# Altium project USV-Central Controller Board.PrjPcb (part 2 of 2)

## Sheet Communication.SchDoc
size 420 x 297 mm; SheetNumber: 3; SheetTotal: 6
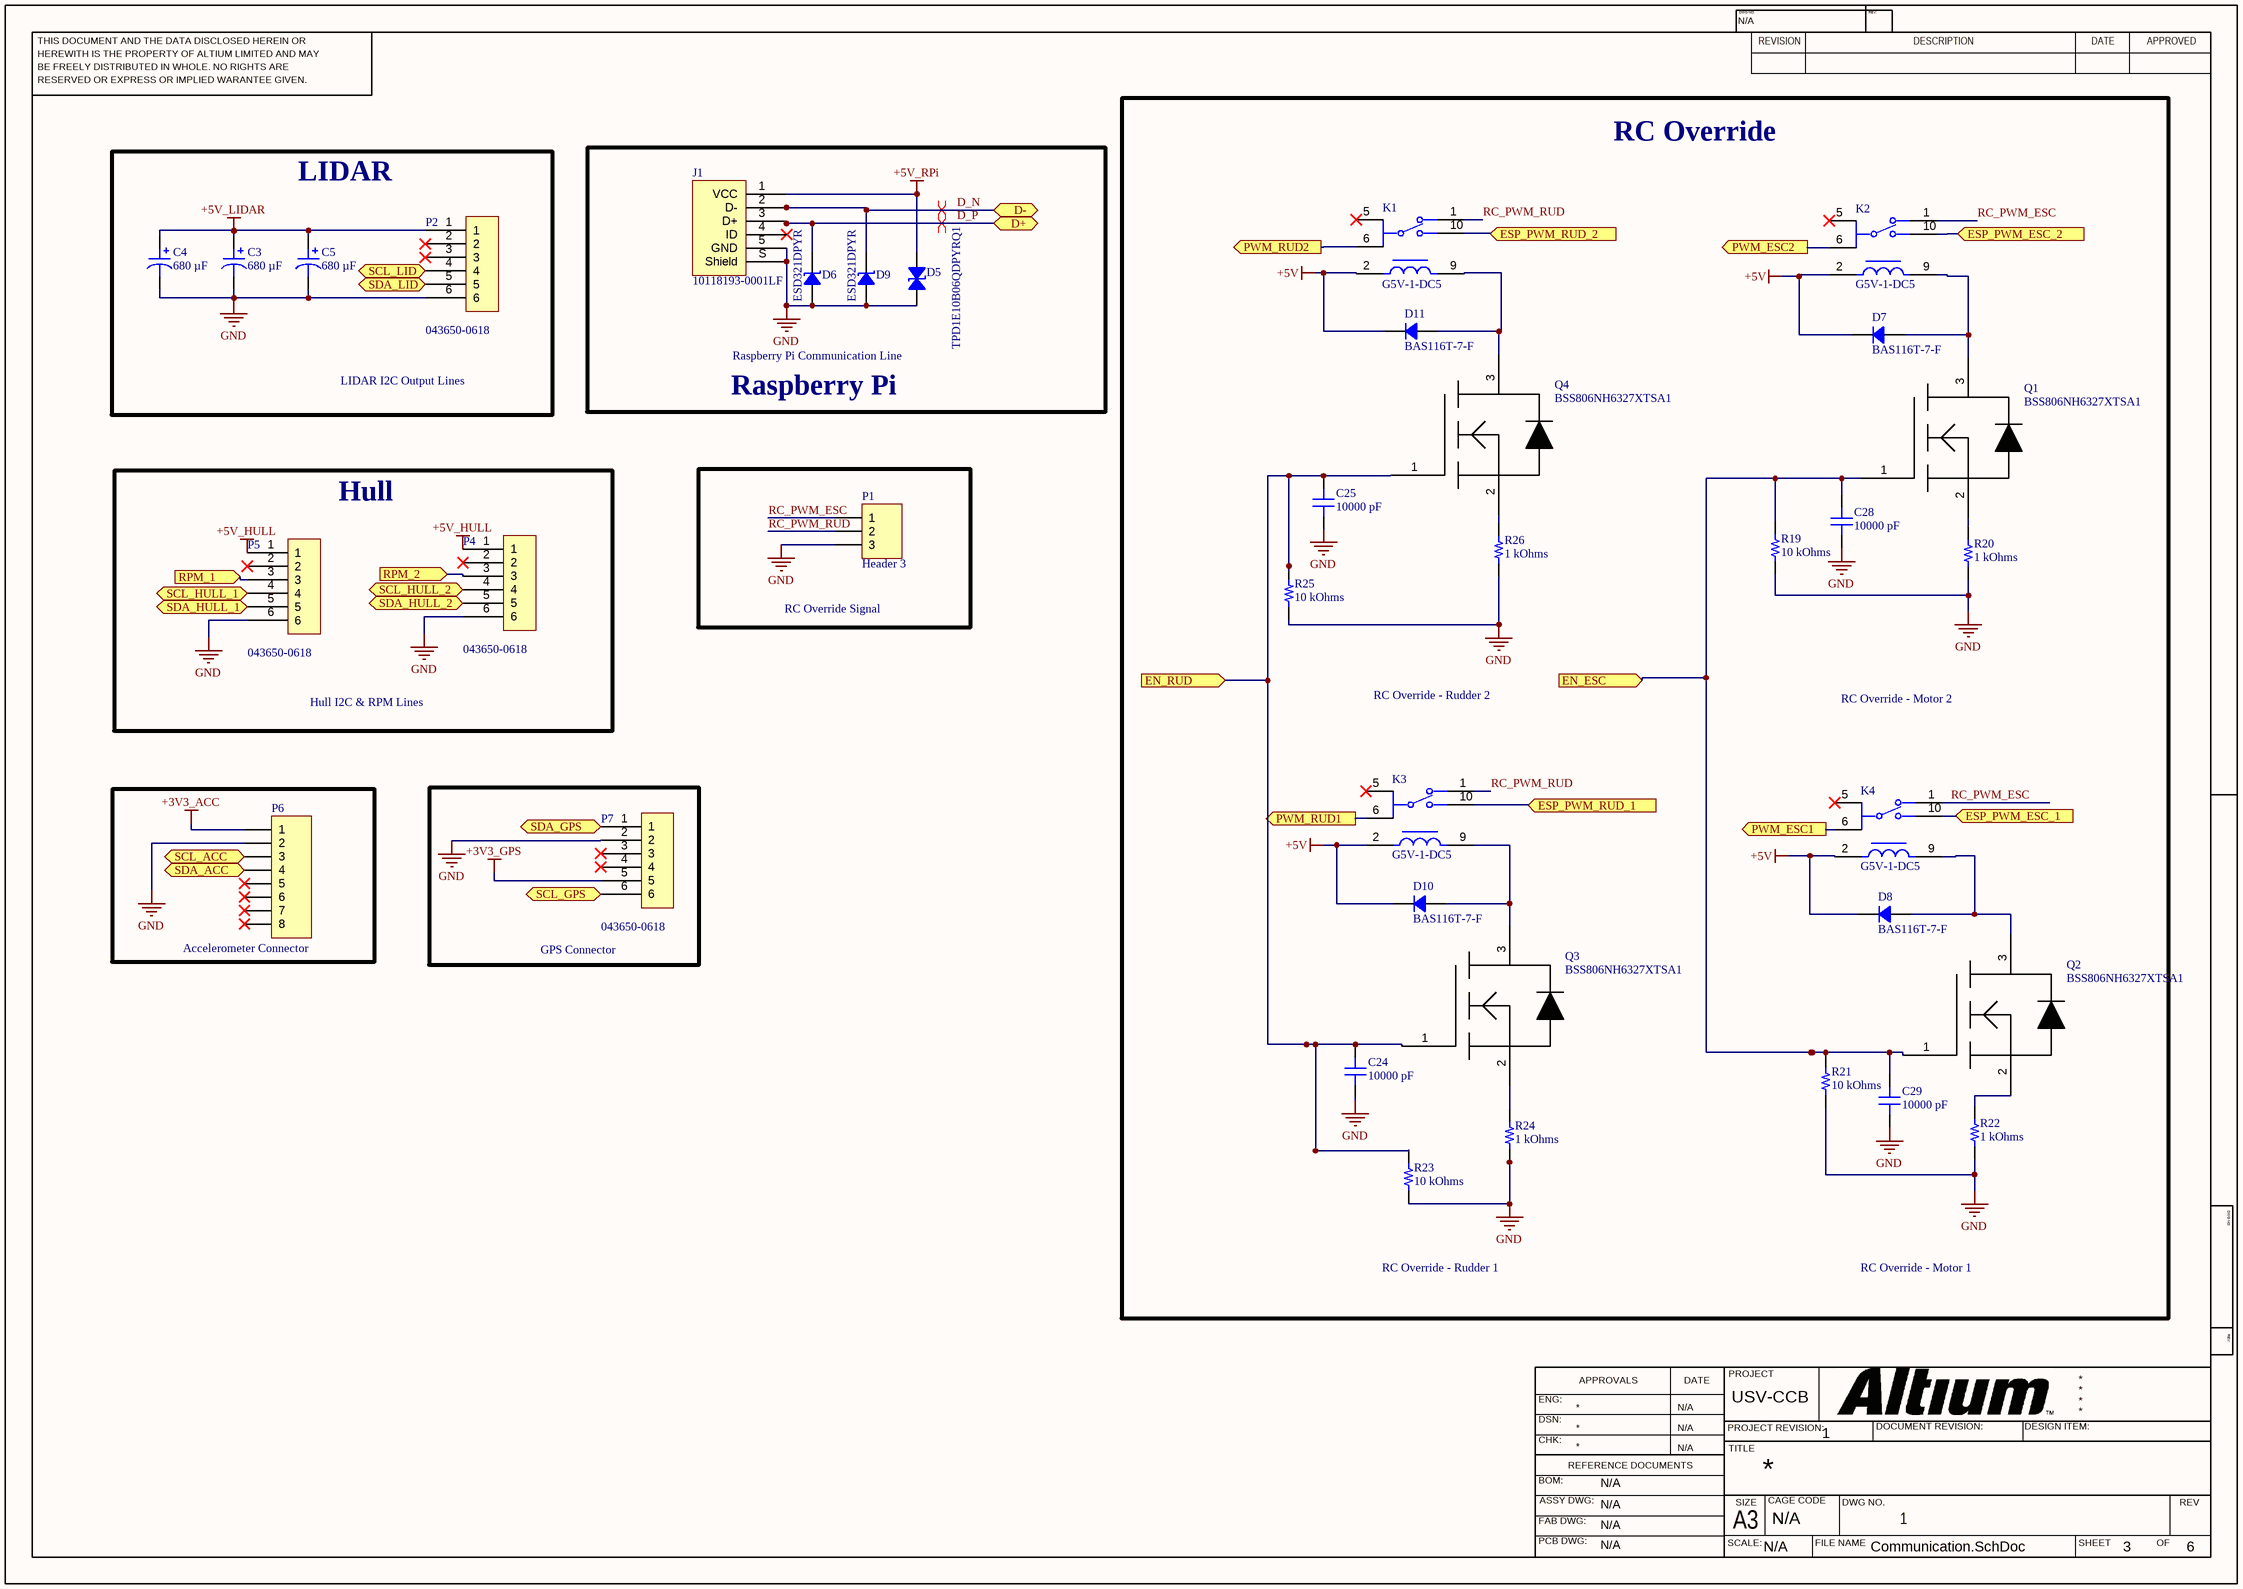
[diagram p4: Communication.SchDoc]

### Parts
C3  680 µF  [CAP ALSMD 8.3MM H10.5MM]
C4  680 µF  [CAP ALSMD 8.3MM H10.5MM]
C5  680 µF  [CAP ALSMD 8.3MM H10.5MM]
C24  10000 pF  [CAP 0603_1608]
C25  10000 pF  [CAP 0603_1608]
C28  10000 pF  [CAP 0603_1608]
C29  10000 pF  [CAP 0603_1608]
D5  TPD1E10B06QDPYRQ1  [0402]
D6  ESD321DPYR  [0402]
D7  BAS116T-7-F  [DIODES SOT-523]
D8  BAS116T-7-F  [DIODES SOT-523]
D9  ESD321DPYR  [0402]
D10  BAS116T-7-F  [DIODES SOT-523]
D11  BAS116T-7-F  [DIODES SOT-523]
J1  10118193-0001LF  [FCI USB 10118193-0001LF]
K1  G5V-1-DC5  [FP-G5V-1-MFG]
K2  G5V-1-DC5  [FP-G5V-1-MFG]
K3  G5V-1-DC5  [FP-G5V-1-MFG]
K4  G5V-1-DC5  [FP-G5V-1-MFG]
P1  Header 3  [HDR1X3]
P2  043650-0618  [043650-0618-Footprint-1]
P4  043650-0618  [043650-0618-Footprint-1]
P5  043650-0618  [043650-0618-Footprint-1]
P6  Accelerometer Connector  [HDR1X8]
P7  043650-0618  [043650-0618-Footprint-1]
Q1  BSS806NH6327XTSA1  [SOT95P255X100-3N]
Q2  BSS806NH6327XTSA1  [SOT95P255X100-3N]
Q3  BSS806NH6327XTSA1  [SOT95P255X100-3N]
Q4  BSS806NH6327XTSA1  [SOT95P255X100-3N]
R19  10 kOhms  [RES 0603_1608]
R20  1 kOhms  [RES 0603_1608]
R21  10 kOhms  [RES 0603_1608]
R22  1 kOhms  [RES 0603_1608]
R23  10 kOhms  [RES 0603_1608]
R24  1 kOhms  [RES 0603_1608]
R25  10 kOhms  [RES 0603_1608]
R26  1 kOhms  [RES 0603_1608]

### Blocks framed on the sheet
RC Override: C24 C25 C28 C29 D7 D8 D10 D11 K1-K4 Q1-Q4 R19-R26
LIDAR: C3-C5 P2
Raspberry Pi: D5 D6 D9 J1
Hull: P4 P5
RC Override Signal: P1
GPS Connector: P7

### Ports
D+ (bidir), D- (bidir), EN_ESC (in), EN_RUD (in), ESP_PWM_ESC_1 (in), ESP_PWM_ESC_2 (in), ESP_PWM_RUD_1 (in), ESP_PWM_RUD_2 (in), PWM_ESC1 (out), PWM_ESC2 (out), PWM_RUD1 (out), PWM_RUD2 (out), RPM_1 (in), RPM_2 (in), SCL_ACC (bidir), SCL_GPS (bidir), SCL_HULL_1 (bidir), SCL_HULL_2 (bidir), SCL_LID (bidir), SDA_ACC (bidir), SDA_GPS (bidir), SDA_HULL_1 (bidir), SDA_HULL_2 (bidir), SDA_LID (bidir)

### Nets
+3V3_ACC: P6.1
+3V3_GPS: P7.5
+5V: D7.2 D8.2 D10.2 D11.2 K1.2 K2.2 K3.2 K4.2
+5V_HULL: P4.1 P5.1
+5V_LIDAR: C3.1 C4.1 C5.1 P2.1
+5V_RPi: D5.1 J1.1(VCC)
GND: C3.2 C4.2 C5.2 C24.2 C25.2 C28.2 C29.2 D5.2 D6.1 D9.1 J1.5(GND) J1.S(Shield) P1.3 P2.6 P4.6 P5.6 P6.2 P7.2 R19.1 R20.1 R21.1 R22.1 R23.1 R24.1 R25.1 R26.1
D_N: D9.2 J1.2(D-) ; port D-
D_P: D6.2 J1.3(D+) ; port D+
RC_PWM_ESC: K2.1 K4.1 P1.1
RC_PWM_RUD: K1.1 K3.1 P1.2
NetC24_1: C24.1 C25.1 Q3.1(GATE) Q4.1(GATE) R23.2 R25.2 ; port EN_RUD
NetC28_1: C28.1 C29.1 Q1.1(GATE) Q2.1(GATE) R19.2 R21.2 ; port EN_ESC
NetD7_1: D7.1 K2.9 Q1.3(DRAIN)
NetD8_1: D8.1 K4.9 Q2.3(DRAIN)
NetD10_1: D10.1 K3.9 Q3.3(DRAIN)
NetD11_1: D11.1 K1.9 Q4.3(DRAIN)
NetJ2_2: K4.6 ; port PWM_ESC1
NetJ3_2: K3.6 ; port PWM_RUD1
NetJ4_2: K2.6 ; port PWM_ESC2
NetJ5_2: K1.6 ; port PWM_RUD2
NetK1_10: K1.10 ; port ESP_PWM_RUD_2
NetK2_10: K2.10 ; port ESP_PWM_ESC_2
NetK3_10: K3.10 ; port ESP_PWM_RUD_1
NetK4_10: K4.10 ; port ESP_PWM_ESC_1
NetMD1_24: P5.3 ; port RPM_1
NetMD1_26: P4.3 ; port RPM_2
NetMD1_33: P2.5 P4.5 P5.5 P6.4 P7.1 ; port SDA_LID, port SDA_ACC, port SDA_HULL_2, port SDA_HULL_1, port SDA_GPS
NetMD1_36: P2.4 P4.4 P5.4 P6.3 P7.6 ; port SCL_ACC, port SCL_GPS, port SCL_HULL_2, port SCL_HULL_1, port SCL_LID
NetQ1_2: Q1.2(SOURCE) R20.2
NetQ2_2: Q2.2(SOURCE) R22.2
NetQ3_2: Q3.2(SOURCE) R24.2
NetQ4_2: Q4.2(SOURCE) R26.2

Not connected (* = marked no-connect by the designer): J1 4(ID)*; K1 5*; K2 5*; K3 5*; K4 5*; P2 2* 3*; P4 2*; P5 2*; P6 5* 6* 7* 8*; P7 3* 4*

### Layout directives
differential pair: D_N, D_P

### Notes on the sheet
- LIDAR I2C Output Lines
- Raspberry Pi Communication Line
- Hull I2C & RPM Lines
- RC Override - Rudder 2
- RC Override - Motor 2
- RC Override - Rudder 1
- RC Override - Motor 1
- THIS DOCUMENT AND THE DATA DISCLOSED HEREIN OR
- HEREWITH IS THE PROPERTY OF ALTIUM LIMITED AND MAY
- DWG NO:
- REVISION
- REV:
- DESCRIPTION
- DATE
- APPROVED
- BE FREELY DISTRIBUTED IN WHOLE. NO RIGHTS ARE
- RESERVED OR EXPRESS OR IMPLIED WARANTEE GIVEN.
- ENG:
- APPROVALS
- PROJECT
- DSN:
- CHK:
- REFERENCE DOCUMENTS
- PROJECT REVISION:
- TITLE
- DOCUMENT REVISION:
- DESIGN ITEM:
- BOM:
- FAB DWG:
- PCB DWG:
- ASSY DWG:
- SCALE:
- A3
- SIZE
- CAGE CODE
- FILE NAME
- DWG NO.
- SHEET
- OF
- REV

### Library data of the parts
C3-C5 = EEE-FK1A681P: CAP ALUM 680UF 20% 10V SMD; manufacturer: Panasonic Electronic Components; Impedance: 160 mOhms; Lifetime @ Temp.: 2000 Hrs @ 105°C; Polarization: Polar; Ripple Current @ High Frequency: 600 mA @ 100 kHz; Ripple Current @ Low Frequency: 450 mA @ 120 Hz; Surface Mount Land Size: 0.327" L x 0.327" W (8.30mm x 8.30mm); Part Number: EEE-FK1A681P; Applications: Automotive; Capacitance: 680 µF; componentlink2description: DigiKey Link; componentlink2url: https://www.digikey.com/en/products/detail/panasonic-electronic-components/EEE-FK1A681P/765951; Device Package: Radial, Can - SMD; Height - Seated (Max): 0.413" (10.50mm); lastupdated: 3/4/2022 6:18:28 PM; Lifecycle Status: Active; Minimum Order: 1; Mounting Type: Surface Mount; Operating Temperature: -55°C ~ 105°C; Package / Case: Radial, Can - SMD; packaging: TapeAndReel; partid: 7615; Part Status: Active; price: 0.34; Ratings: AEC-Q200; series: FK; Size / Dimension: 0.315" Dia (8.00mm); Supplier 1: DigiKey; Supplier Part Number 1: PCE3781CT-ND; Tolerance: ±20%; value: 680 µF; Voltage - Rated: 10 V
C24 C25 C28 C29 = C0603C103K4RECAUTO: CAP CER 0603 10NF 16V X7R 10%; manufacturer: KEMET; Part Number: C0603C103K4RECAUTO; Value: 10000 pF; Applications: Automotive, ESD Protection; Capacitance: 10000 pF; componentlink1description: Datasheet; componentlink1url: https://api.kemet.com/component-edge/download/datasheet/C0603C103K4RECAUTO.pdf; componentlink2description: DigiKey Link; componentlink2url: https://www.digikey.com/en/products/detail/kemet/C0603C103K4RECAUTO/8640474; Device Package: 0603 (1608 Metric); lastupdated: 2022-06-14 2:44:13 AM; Lifecycle Status: Active; Minimum Order: 1; Mounting Type: Surface Mount, MLCC; Operating Temperature: -55°C ~ 125°C; Package / Case: 0603 (1608 Metric); packaging: TapeAndReel; partid: 8251; Part Status: Active; price: 0.02; Ratings: AEC-Q200; series: ESD SMD Auto X7R; Size / Dimension: 0.063" L x 0.031" W (1.60mm x 0.80mm); Supplier 1: DigiKey; Supplier Part Number 1: 399-17880-1-ND; Temperature Coefficient: X7R; Thickness (Max): 0.034" (0.87mm); Tolerance: ±10%; Voltage - Rated: 16V
D5 = TPD1E10B06QDPYRQ1: TVS DIODE 5.5VWM 14VC 2X1SON; Manufacturer: Texas Instruments; Bidirectional Channels: 1; Capacitance @ Frequency: 12pF @ 1MHz; Current - Peak Pulse (10/1000µs): 6A (8/20µs); Power Line Protection: No; Power - Peak Pulse: 90W; Type: Zener; Voltage - Breakdown (Min): 6V; Voltage - Clamping (Max) @ Ipp: 14V (Typ); Voltage - Reverse Standoff (Typ): 5.5V (Max); Part Number: TPD1E10B06QDPYRQ1; Applications: Automotive; ComponentLink1Description: Datasheet; ComponentLink1URL: http://www.ti.com/general/docs/suppproductinfo.tsp?distId=10&gotoUrl=http%3A%2F%2Fwww.ti.com%2Flit%2Fgpn%2Ftpd1e10b06-q1; ComponentLink2Description: DigiKey Link; ComponentLink2URL: https://www.digikey.com/en/products/detail/texas-instruments/TPD1E10B06QDPYRQ1/6609845; Device Package: 0402 (1005 Metric); LastUpdated: 2022-09-19 2:05:54 PM; Lifecycle Status: Active; Minimum Order: 1; Mounting Type: Surface Mount; Operating Temperature: -40°C ~ 125°C (TA); Package / Case: 0402 (1005 Metric); Packaging: TapeAndReel; PartId: 10475; Part Status: Active; Price: 0.09; Series: Automotive, AEC-Q101; Supplier 1: DigiKey; Supplier Part Number 1: 296-TPD1E10B06QDPYRQ1CT-ND; Supplier Device Package: 2-X1SON (1x.60)
D6 D9 = ESD321DPYR: TVS DIODE 3.6VWM 6.8VC 2X1SON; Manufacturer: Texas Instruments; Capacitance @ Frequency: 0.9pF @ 1MHz; Current - Peak Pulse (10/1000µs): 6A (8/20µs); Power Line Protection: No; Power - Peak Pulse: 40W; Type: Zener; Unidirectional Channels: 1; Voltage - Breakdown (Min): 4.5V; Voltage - Clamping (Max) @ Ipp: 6.8V (Typ); Voltage - Reverse Standoff (Typ): 3.6V (Max); Part Number: ESD321DPYR; Applications: General Purpose; ComponentLink1Description: Datasheet; ComponentLink1URL: http://www.ti.com/general/docs/suppproductinfo.tsp?distId=10&gotoUrl=http%3A%2F%2Fwww.ti.com%2Flit%2Fgpn%2Fesd321; ComponentLink2Description: DigiKey Link; ComponentLink2URL: https://www.digikey.com/en/products/detail/texas-instruments/ESD321DPYR/9559035; Device Package: 0402 (1005 Metric); LastUpdated: 2022-09-19 2:05:48 PM; Lifecycle Status: Active; Minimum Order: 1; Mounting Type: Surface Mount; Operating Temperature: -40°C ~ 125°C (TA); Package / Case: 0402 (1005 Metric); Packaging: TapeAndReel; PartId: 11534; Part Status: Active; Price: 0.10; Series: -; Supplier 1: DigiKey; Supplier Part Number 1: 296-51108-1-ND; Supplier Device Package: 2-X1SON (1x.60)
D7 D8 D10 D11 = BAS116T-7-F: DIODE GEN PURP 85V 215MA SOT523; Manufacturer: Diodes Incorporated; Current - Average Rectified (Io): 215mA (DC); Current - Reverse Leakage @ Vr: 5nA @ 75V; Diode Type: Standard; Reverse Recovery Time (trr): 3µs; Speed: Standard Recovery >500ns, > 200mA (Io); Voltage - Forward (Vf) (Max) @ If: 1.25V @ 150mA; Part Number: BAS116T-7-F; ComponentLink1Description: Datasheet; ComponentLink1URL: https://www.diodes.com/assets/Datasheets/ds30258.pdf; ComponentLink2Description: DigiKey Link; ComponentLink2URL: http://digikey.com/product-detail/en/diodes-incorporated/BAS116T-7-F/BAS116T-FDICT-ND/815338; LastUpdated: 4/12/2022 10:52:55 PM; Lifecycle Status: Active; Minimum Order: 1; Mounting Type: Surface Mount; Operating Temperature - Junction: -65°C ~ 150°C; Package / Case: SOT-523; Packaging: TapeAndReel; PartId: 1; Part Status: Active; Price: 0.06; Series: -; Supplier 1: DigiKey; Supplier Part Number 1: BAS116T-FDICT-ND; Supplier Device Package: SOT-523; Voltage - DC Reverse (Vr) (Max): 85V
J1 = 10118193-0001LF: CONN RCPT USB2.0 MICRO B SMD R/A; Manufacturer: Amphenol ICC (FCI); Connector Type: USB - micro B; Current Rating (Amps): 1.8A per Contact; Gender: Receptacle; Mating Cycles: 10000; Number of Contacts: 5; Number of Ports: 1; Shielding: Shielded; Voltage - Rated: 100VAC; Part Number: 10118193-0001LF; ComponentLink1Description: Datasheet; ComponentLink1URL: https://cdn.amphenol-icc.com/media/wysiwyg/files/documentation/datasheet/inputoutput/io_usb_micro.pdf; ComponentLink2Description: DigiKey Link; ComponentLink2URL: //digikey.com/product-detail/en/amphenol-icc-fci/10118193-0001LF/609-4616-2-ND/2785388; Features: Solder Retention; LastUpdated: 2019-12-09 8:51:28 PM; Lifecycle Status: 0; Minimum Order: 1; Mounting Feature: Horizontal; Mounting Type: Surface Mount, Right Angle; Through Hole; Operating Temperature: -30°C ~ 80°C; Packaging: TapeAndReel; Part Status: Active; Price: 0.21; Series: -; Specifications: USB 2.0; Supplier 1: DigiKey; Supplier Part Number 1: 609-4616-2-ND; Termination: Solder
K1-K4 = CMP-2000-05293-2: RELAY GEN PURPOSE SPDT 1A 5VDC; Manufacturer: Omron; Coil Power: 150mW; Coil Voltage: 5V; Standoff Height: 0.5mm; Coil Type: Non-Latching; Coil Resistance: 167Ω; Number Of Contacts: 1; Coil Current: 30mA; Current Rating: 2A; Temperature: -40°C to +70°C; Manufacturer Part Number: G5V-1-DC5; Lead Free: Yes; RoHS: TRUE; Category: Relay; ComponentLink2Description: Datasheet; Ambient Temperature Range Low: -40°C; Digikey Description: RELAY GEN PURPOSE SPDT 1A 5VDC; Temperature Range High: +70°C; Package: G5V-1; Throw Configuration: SPDT; Switching Current: 1A; Height: 10mm; Device Class L2: Relays; Ambient Temperature Range High: +70°C; Temperature Range Low: -40°C; Octopart: https://octopart.com/g5v-1-dc5-omron-6846; Device Class L1: Electromechanical; ComponentLink2URL: https://omronfs.omron.com/en_US/ecb/products/pdf/en-g5v_1.pdf; Automotive: No; Device Class L3: Signal Relays
P1 = Header 3: Header, 3-Pin; LatestRevisionDate: 17-Jul-2002; LatestRevisionNote: Re-released for DXP Platform.; Publisher: Altium Limited
P2 P4 P5 P7 = CMP-00026-1: Conn Power HDR 6 POS 3mm Solder ST Thru-Hole 6 Terminal 1 Port Micro-Fit 3.0™ Tray; Number of Ports: 1; Number of Contacts: 6; Connector Type: Male Pin; RoHS Compliant: Yes; Termination: Solder; Contact Plating: Tin; Orientation: Straight; Packaging: Tray; Length: 21.64mm; Number of Terminals/Pins: 6; Number of Positions: 6; Min Operating Temperature: -40°C; Fastening Type: Ramp; Contact Material: Brass; Depth: 5.57mm; Pitch: 3mm; Housing Material: Polymer; Max Operating Temperature: 105°C; Color: Black; Mount: Through Hole; Package Quantity: 1530; Number of Rows: 1
P6 = Header 8: Header, 8-Pin; LatestRevisionDate: 17-Jul-2002; LatestRevisionNote: Re-released for DXP Platform.; Publisher: Altium Limited
Q1-Q4 = CMP-00034-3: Single N-Channel 20 V 57 mOhm 1.7 nC OptiMOS Small Signal Mosfet - SOT-23; Rise Time: 9.9ns; Gate to Source Voltage (Vgs): 8V; Drain to Source Voltage (Vdss): 20V; Rds On Max: 57mR; Continuous Drain Current (ID): 2.3A; Max Power Dissipation: 500mW; Input Capacitance: 529pF; RoHS Compliant: Yes; Packaging: Cut Tape; Min Operating Temperature: -55°C; Halogen Free: Halogen Free; Mount: Surface Mount; Max Operating Temperature: 150°C; Max Dual Supply Voltage: 20V; Case/Package: SOT-23; Series: OptiMOS™; Lead Free: Lead Free
R19 R21 R23 R25 = RNCS0603BKE10K0: RES 10K OHM 0.1% 1/16W 0603; Manufacturer: Stackpole Electronics Inc; Power (Watts): 0.063W, 1/16W; Temperature Coefficient: ±25ppm/°C; Part Number: RNCS0603BKE10K0; Value: 10 kOhms; ComponentLink1Description: Datasheet; ComponentLink1URL: https://www.seielect.com/catalog/sei-rncs_rnch.pdf; ComponentLink2Description: DigiKey Link; ComponentLink2URL: https://www.digikey.com/en/products/detail/stackpole-electronics-inc/RNCS0603BKE10K0/1708836; Composition: Thin Film; Device Package: 0603 (1608 Metric); Features: Anti-Corrosive, Automotive AEC-Q200, Moisture Resistant; Height - Seated (Max): 0.022" (0.55mm); LastUpdated: 4/12/2022 10:27:55 PM; Lifecycle Status: Active; Minimum Order: 1; Number of Terminations: 2; Operating Temperature: -55°C ~ 155°C; Package / Case: 0603 (1608 Metric); Packaging: TapeAndReel; PartId: 4838; Part Status: Active; Price: 0.08; Ratings: AEC-Q200; Resistance: 10 kOhms; Series: RNCS; Size / Dimension: 0.061" L x 0.031" W (1.55mm x 0.80mm); Supplier 1: DigiKey; Supplier Part Number 1: RNCS0603BKE10K0CT-ND; Supplier Device Package: 0603; Tolerance: ±0.1%
R20 R22 R24 R26 = RNCS0603BKE10K0: RES 10K OHM 0.1% 1/16W 0603; Manufacturer: Stackpole Electronics Inc; Power (Watts): 0.063W, 1/16W; Resistance: 10 kOhms; Temperature Coefficient: ±25ppm/°C; Part Number: RNCS0603BKE10K0; Value: 1 kOhms; ComponentLink1Description: Datasheet; ComponentLink1URL: https://www.seielect.com/catalog/sei-rncs_rnch.pdf; ComponentLink2Description: DigiKey Link; ComponentLink2URL: https://www.digikey.com/en/products/detail/stackpole-electronics-inc/RNCS0603BKE10K0/1708836; Composition: Thin Film; Device Package: 0603 (1608 Metric); Features: Anti-Corrosive, Automotive AEC-Q200, Moisture Resistant; Height - Seated (Max): 0.022" (0.55mm); LastUpdated: 4/12/2022 10:27:55 PM; Lifecycle Status: Active; Minimum Order: 1; Number of Terminations: 2; Operating Temperature: -55°C ~ 155°C; Package / Case: 0603 (1608 Metric); Packaging: TapeAndReel; PartId: 4838; Part Status: Active; Price: 0.08; Ratings: AEC-Q200; Series: RNCS; Size / Dimension: 0.061" L x 0.031" W (1.55mm x 0.80mm); Supplier 1: DigiKey; Supplier Part Number 1: RNCS0603BKE10K0CT-ND; Supplier Device Package: 0603; Tolerance: ±0.1%

## Sheet Output Connections.SchDoc
size 420 x 297 mm; SheetNumber: 4; SheetTotal: 6
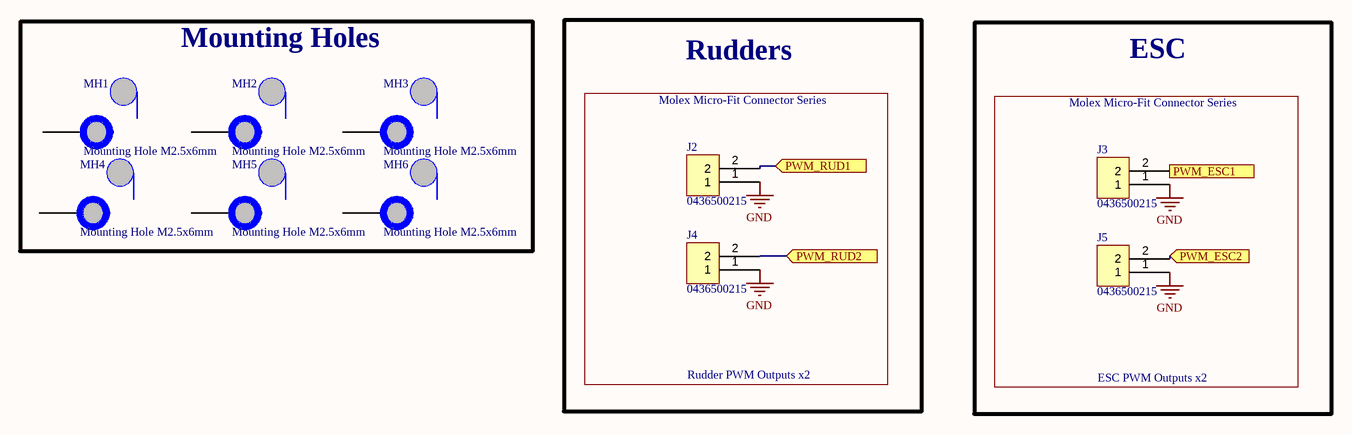
[diagram p5: Output Connections.SchDoc]

### Parts
J2  0436500215  [0436500215-Footprint-1]
J3  0436500215  [0436500215-Footprint-1]
J4  0436500215  [0436500215-Footprint-1]
J5  0436500215  [0436500215-Footprint-1]
MH1  Mounting Hole M2.5x6mm  [Mounting Hole M2.5x6mm-Footprint-1]
MH2  Mounting Hole M2.5x6mm  [Mounting Hole M2.5x6mm-Footprint-1]
MH3  Mounting Hole M2.5x6mm  [Mounting Hole M2.5x6mm-Footprint-1]
MH4  Mounting Hole M2.5x6mm  [Mounting Hole M2.5x6mm-Footprint-1]
MH5  Mounting Hole M2.5x6mm  [Mounting Hole M2.5x6mm-Footprint-1]
MH6  Mounting Hole M2.5x6mm  [Mounting Hole M2.5x6mm-Footprint-1]

### Blocks framed on the sheet
Mounting Holes: MH1-MH6
Rudders: J2 J4
ESC: J3 J5

### Ports
PWM_ESC1 (in), PWM_ESC2 (in), PWM_RUD1 (in), PWM_RUD2 (in)

### Nets
GND: J2.1 J3.1 J4.1 J5.1
NetJ2_2: J2.2 ; port PWM_RUD1
NetJ3_2: J3.2 ; port PWM_ESC1
NetJ4_2: J4.2 ; port PWM_RUD2
NetJ5_2: J5.2 ; port PWM_ESC2

Not connected (* = marked no-connect by the designer): MH1 0; MH2 0; MH3 0; MH4 0; MH5 0; MH6 0

### Notes on the sheet
- Molex Micro-Fit Connector Series
- Rudder PWM Outputs x2
- ESC PWM Outputs x2
- THIS DOCUMENT AND THE DATA DISCLOSED HEREIN OR
- HEREWITH IS THE PROPERTY OF ALTIUM LIMITED AND MAY
- DWG NO:
- REVISION
- REV:
- DESCRIPTION
- DATE
- APPROVED
- BE FREELY DISTRIBUTED IN WHOLE. NO RIGHTS ARE
- RESERVED OR EXPRESS OR IMPLIED WARANTEE GIVEN.
- ENG:
- APPROVALS
- PROJECT
- DSN:
- CHK:
- REFERENCE DOCUMENTS
- PROJECT REVISION:
- TITLE
- DOCUMENT REVISION:
- DESIGN ITEM:
- BOM:
- FAB DWG:
- PCB DWG:
- ASSY DWG:
- SCALE:
- A3
- SIZE
- CAGE CODE
- FILE NAME
- DWG NO.
- SHEET
- OF
- REV

### Library data of the parts
J2-J5 = CMP-00008-2: Header 1 Row Vertical Polarizing Peg 2 Pin SMT/Glow Wire Compatible Tin Plate; Number of Positions: 2; Max Voltage Rating (DC): 250V; Number of Ports: 1; Pitch: 3mm; Contact Resistance: 30mR; Connector Type: Male Pin; Mount: Through Hole; Depth: 5.57mm; Series: Micro-Fit 3.0™ 43650; Housing Material: Polymer; Max Operating Temperature: 105°C; Fastening Type: Ramp; Color: Black; Length: 9.65mm; Contact Plating: Tin; Number of Rows: 1; Housing Color: Black; RoHS Compliant: Yes; Orientation: Straight; Packaging: Tray; Number of Contacts: 2; Termination: Solder; Contact Material: Brass; Max Voltage Rating (AC): 250V; Min Operating Temperature: -40°C; Number of Terminals/Pins: 2; Contact Type: Male Pin
MH1-MH6 = CMP-00006-5: M2.5 Mounting Hole

## Nets that join several sheets
+3V3: Power (C21.1 D4.2 U5.2), Microcontroller (14 pins)
+3V3_ACC: Power (C22.2 C23.2 U5.6), Communication (P6.1)
+3V3_GPS: Power (C16.1 C17.2 U5.7), Communication (P7.5)
+5V: Power (9 pins), Input Connections (J6.2), Communication (8 pins)
+5V_HULL: Power (C19.2 C20.2 U4.6), Communication (P4.1 P5.1)
+5V_LIDAR: Power (C15.1 U4.7), Communication (C3.1 C4.1 C5.1 P2.1)
+5V_RPi: Microcontroller (C6.2 C7.2 U2.7 U2.8), Communication (D5.1 J1.1)
GND: Power (16 pins), Microcontroller (20 pins), Input Connections (J6.1), Communication (26 pins), Output Connections (J2.1 J3.1 J4.1 J5.1)
D_N: Microcontroller (TP3.1 U2.4), Communication (D9.2 J1.2)
D_P: Microcontroller (TP4.1 U2.5), Communication (D6.2 J1.3)
NetC24_1: Microcontroller (MD1.9), Communication (6 pins)
NetC28_1: Microcontroller (MD1.8), Communication (6 pins)
NetJ2_2: Communication (K4.6), Output Connections (J2.2)
NetJ3_2: Communication (K3.6), Output Connections (J3.2)
NetJ4_2: Communication (K2.6), Output Connections (J4.2)
NetJ5_2: Communication (K1.6), Output Connections (J5.2)
NetK1_10: Microcontroller (MD1.29), Communication (K1.10)
NetK2_10: Microcontroller (MD1.13), Communication (K2.10)
NetK3_10: Microcontroller (MD1.14), Communication (K3.10)
NetK4_10: Microcontroller (MD1.16), Communication (K4.10)
NetMD1_10: Power (R15.1 U4.4), Microcontroller (MD1.10)
NetMD1_11: Power (R18.1 U5.3), Microcontroller (MD1.11)
NetMD1_12: Power (R17.1 U5.4), Microcontroller (MD1.12)
NetMD1_24: Microcontroller (MD1.24), Communication (P5.3)
NetMD1_26: Microcontroller (MD1.26), Communication (P4.3)
NetMD1_33: Microcontroller (MD1.33 R7.1), Communication (5 pins)
NetMD1_36: Microcontroller (MD1.36 R8.1), Communication (5 pins)
NetMD1_37: Power (R16.1 U4.3), Microcontroller (MD1.37)